# Altium schematic sheet MotherBoard.SchDoc: 3D Printer Motherboard
size Legal; DrawnBy: Sean & Zika; DocumentNumber: 1; Revision: 1.0; SheetNumber: 1; SheetTotal: 2
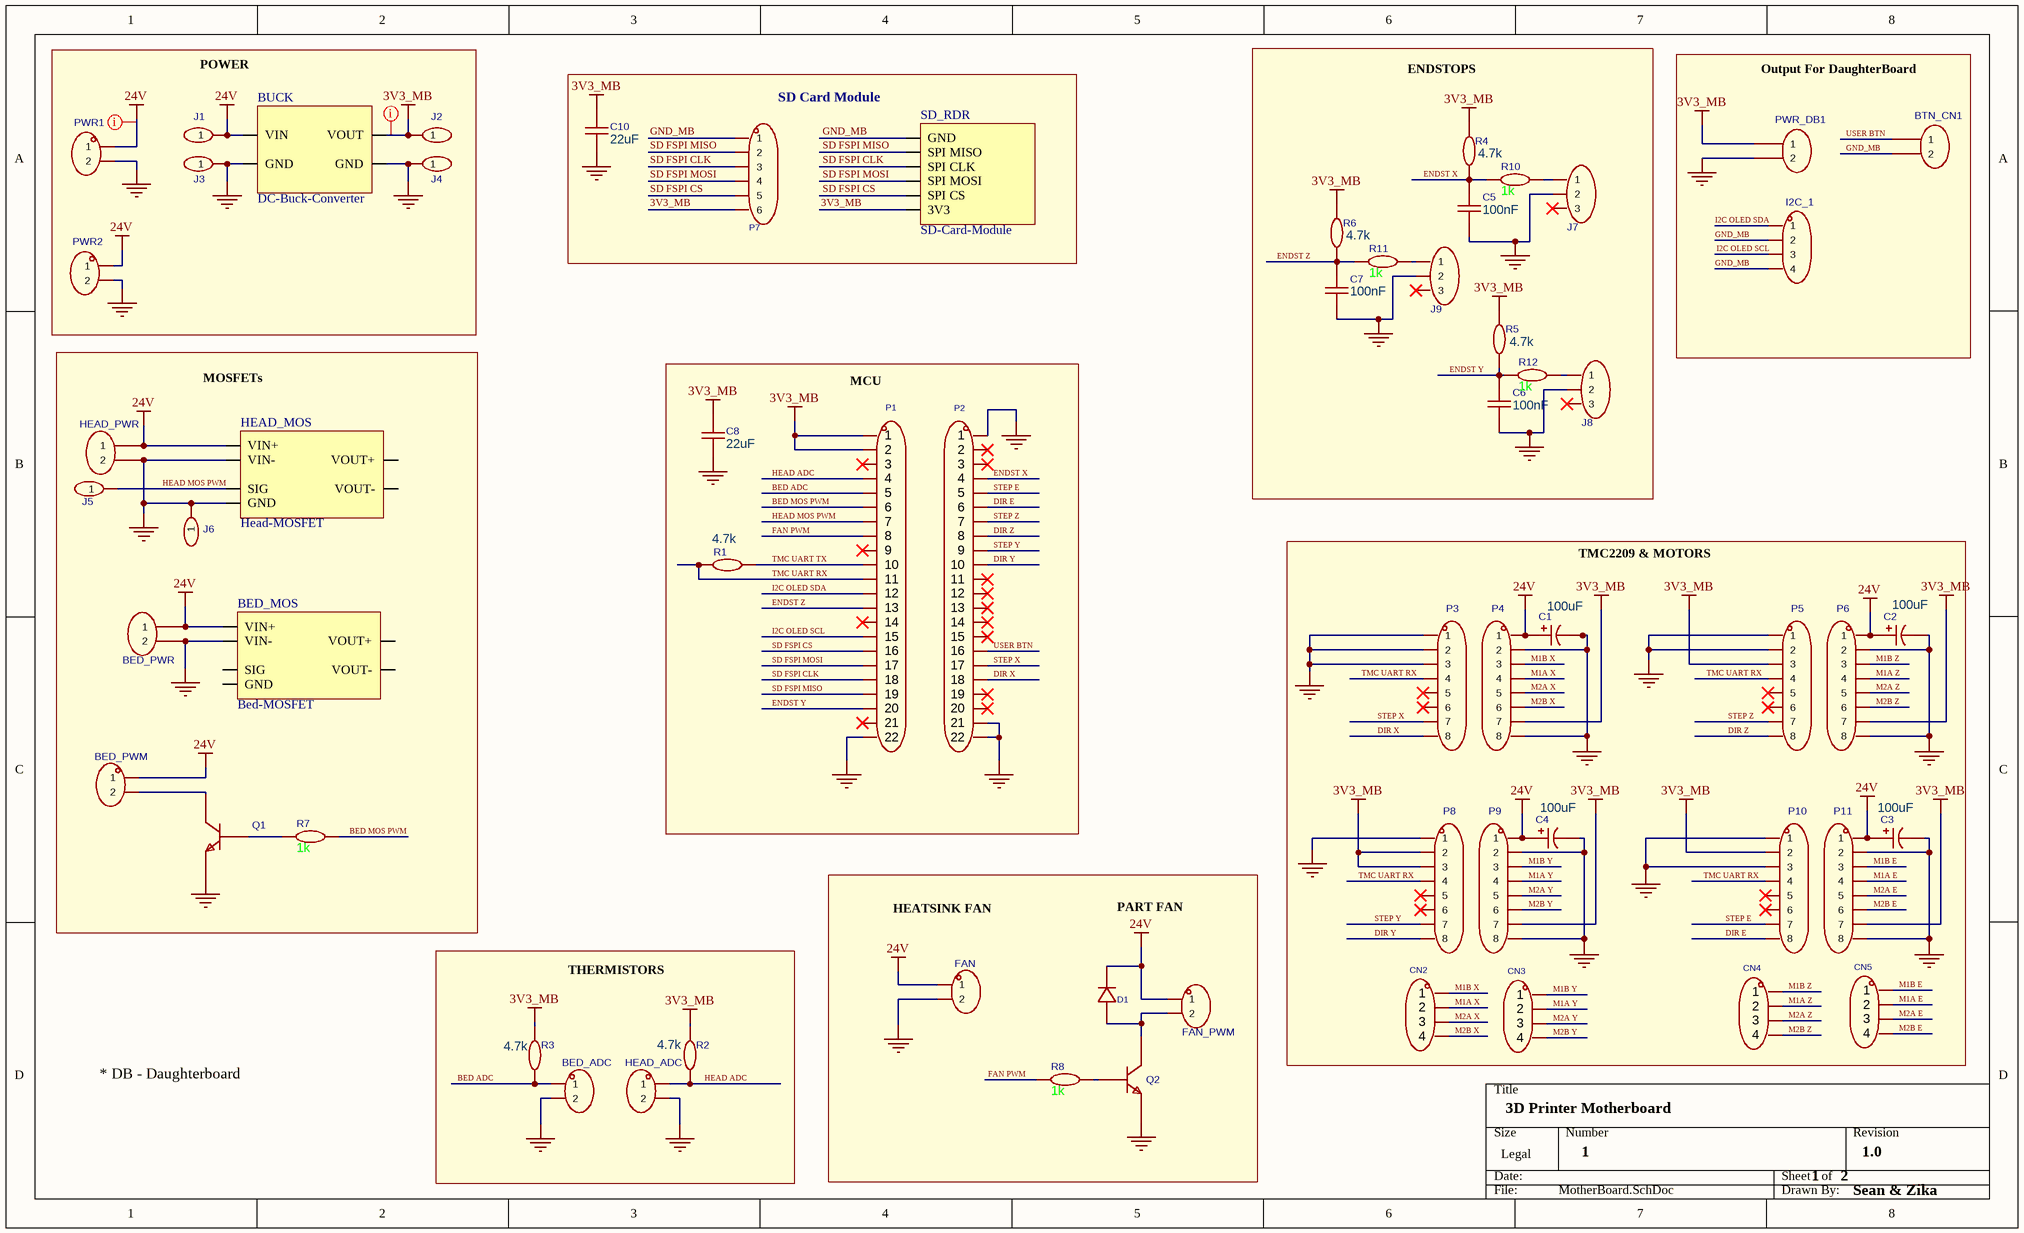
[diagram p0: MotherBoard.SchDoc]

## Parts
BED_ADC  sh-xh2.54-2p  [XH-2P]  (value not drawn)
BED_MOS  Bed-MOSFET  [Bed-MOSFET]  (graphical)
BED_PWM  sh-xh2.54-2p  [XH-2P]  (value not drawn)
BED_PWR  wj127-5.0-02p-14-00a  [Screw-Terminal-2P]  (value not drawn)
BTN_CN1  wj127-5.0-02p-14-00a  [Screw-Terminal-2P]  (value not drawn)
BUCK  DC-Buck-Converter  [DC-Buck-Converter]  (graphical)
C1  100uF  [Capacitor-100uF]
C2  100uF  [Capacitor-100uF]
C3  100uF  [Capacitor-100uF]
C4  100uF  [Capacitor-100uF]
C5  100nF  [Capacitor-100nF-0805]
C6  100nF  [Capacitor-100nF-0805]
C7  100nF  [Capacitor-100nF-0805]
C8  22uF  [Capacitor-22uF-0805]
C10  22uF  [Capacitor-22uF-0805]
CN2  sh-xh2.54-4p  [XH-4P]  (value not drawn)
CN3  sh-xh2.54-4p  [XH-4P]  (value not drawn)
CN4  sh-xh2.54-4p  [XH-4P]  (value not drawn)
CN5  sh-xh2.54-4p  [XH-4P]  (value not drawn)
D1  s3mb-13-f  [Diode-1N4007-SMA]  (value not drawn)
FAN  sh-xh2.54-2p  [XH-2P]  (value not drawn)
FAN_PWM  sh-xh2.54-2p  [XH-2P]  (value not drawn)
HEAD_ADC  sh-xh2.54-2p  [XH-2P]  (value not drawn)
HEAD_MOS  Head-MOSFET  [Head-MOSFET]  (graphical)
HEAD_PWR  wj127-5.0-02p-14-00a  [Screw-Terminal-2P]  (value not drawn)
I2C_1  wj127-5.0-04p-14-00a  [Screw-Terminal-4P]  (value not drawn)
J1  2.54-1*1p针  [Male-Header-1P]  (value not drawn)
J2  2.54-1*1p针  [Male-Header-1P]  (value not drawn)
J3  2.54-1*1p针  [Male-Header-1P]  (value not drawn)
J4  2.54-1*1p针  [Male-Header-1P]  (value not drawn)
J5  2.54-1*1p针  [Male-Header-1P]  (value not drawn)
J6  2.54-1*1p针  [Male-Header-1P]  (value not drawn)
J7  2.54-1*3p针  [Male-Header-3P]  (value not drawn)
J8  2.54-1*3p针  [Male-Header-3P]  (value not drawn)
J9  2.54-1*3p针  [Male-Header-3P]  (value not drawn)
P1  fh2.54-09-22pzd  [Female-Header-22P]  (value not drawn)
P2  fh2.54-09-22pzd  [Female-Header-22P]  (value not drawn)
P3  2.54-1*8p母环保  [Female-Header-8P]  (value not drawn)
P4  2.54-1*8p母环保  [Female-Header-8P]  (value not drawn)
P5  2.54-1*8p母环保  [Female-Header-8P]  (value not drawn)
P6  2.54-1*8p母环保  [Female-Header-8P]  (value not drawn)
P7  2.54-1*6p  [Female-Header-6P]  (value not drawn)
P8  2.54-1*8p母环保  [Female-Header-8P]  (value not drawn)
P9  2.54-1*8p母环保  [Female-Header-8P]  (value not drawn)
P10  2.54-1*8p母环保  [Female-Header-8P]  (value not drawn)
P11  2.54-1*8p母环保  [Female-Header-8P]  (value not drawn)
PWR1  dbt30s-7.62-2p-bk-p  [Barrier-Terminal-2P]  (value not drawn)
PWR2  dbt30s-7.62-2p-bk-p  [Barrier-Terminal-2P]  (value not drawn)
PWR_DB1  wj127-5.0-02p-14-00a  [Screw-Terminal-2P]  (value not drawn)
Q1  ktc3265(range:160-320)  [NPN-SOT23-30V]  (value not drawn)
Q2  ktc3265(range:160-320)  [NPN-SOT23-30V]  (value not drawn)
R1  4.7k  [Resistor-4.7k-0805]
R2  4.7k  [Resistor-4.7k-0805]
R3  4.7k  [Resistor-4.7k-0805]
R4  4.7k  [Resistor-4.7k-0805]
R5  4.7k  [Resistor-4.7k-0805]
R6  4.7k  [Resistor-4.7k-0805]
R7  1k  [Resistor-1k-0805]
R8  1k  [Resistor-1k-0805]
R10  1k  [Resistor-1k-0805]
R11  1k  [Resistor-1k-0805]
R12  1k  [Resistor-1k-0805]
SD_RDR  SD-Card-Module  [SD-Card-Module]  (graphical)

## Blocks framed on the sheet
POWER: BUCK J1-J4 PWR1 PWR2
SD Card Module: C10 P7 SD_RDR
ENDSTOPS: C5-C7 J7-J9 R4-R6 R10-R12
Output For DaughterBoard: BTN_CN1 I2C_1 PWR_DB1
MOSFETs: BED_MOS BED_PWM BED_PWR HEAD_MOS HEAD_PWR J5 J6 Q1 R7
MCU: C8 P1 P2 R1
TMC2209 & MOTORS: C1-C4 CN2-CN5 P3-P6 P8-P11
THERMISTORS: BED_ADC HEAD_ADC R2 R3

## Nets
3V3_MB: BUCK.3(VOUT) C8.2 C10.1 J2.1 P1.1 P1.2 P4.7 P5.3 P6.7 P7.6 P8.2 P8.3 P9.7 P10.2 P11.7 PWR_DB1.1 R2.1 R3.2 R4.2 R5.2 R6.2 SD_RDR.6(3V3)
24V: BED_MOS.1(VIN+) BED_PWM.1 BED_PWR.1 BUCK.1(VIN) C1.1 C2.1 C3.1 C4.1 D1.1 FAN.1 FAN_PWM.1 HEAD_MOS.1(VIN+) HEAD_PWR.1 J1.1 P4.1 P6.1 P9.1 P11.1 PWR1.1 PWR2.1
GND_MB: BED_ADC.2 BED_MOS.2(VIN-) BED_PWR.2 BTN_CN1.2 BUCK.2(GND) BUCK.4(GND) C1.2 C2.2 C3.2 C4.2 C5.1 C6.1 C7.1 C8.1 C10.2 FAN.2 HEAD_ADC.2 HEAD_MOS.2(VIN-) HEAD_MOS.4(GND) HEAD_PWR.2 I2C_1.2 I2C_1.4 J3.1 J4.1 J6.1 J7.2 J8.2 J9.2 P1.22 P2.1 P2.21 P2.22 P3.1 P3.2 P3.3 P4.2 P4.8 P5.1 P5.2 P6.2 P6.8 P7.1 P8.1 P9.2 P9.8 P10.1 P10.3 P11.2 P11.8 PWR1.2 PWR2.2 PWR_DB1.2 Q1.2(E) Q2.2(E) SD_RDR.1(GND)
BED ADC: BED_ADC.1 P1.5 R3.1
BED MOS PWM: P1.6 R7.2
DIR E: P2.6 P10.8
DIR X: P2.18 P3.8
DIR Y: P2.10 P8.8
DIR Z: P2.8 P5.8
ENDST X: C5.2 P2.4 R4.1 R10.1
ENDST Y: C6.2 P1.20 R5.1 R12.1
ENDST Z: C7.2 P1.13 R6.1 R11.1
FAN PWM: P1.8 R8.1
HEAD ADC: HEAD_ADC.1 P1.4 R2.2
HEAD MOS PWM: HEAD_MOS.3(SIG) J5.1 P1.7
I2C OLED SCL: I2C_1.3 P1.15
I2C OLED SDA: I2C_1.1 P1.12
M1A E: CN5.2 P11.4
M1A X: CN2.2 P4.4
M1A Y: CN3.2 P9.4
M1A Z: CN4.2 P6.4
M1B E: CN5.1 P11.3
M1B X: CN2.1 P4.3
M1B Y: CN3.1 P9.3
M1B Z: CN4.1 P6.3
M2A E: CN5.3 P11.5
M2A X: CN2.3 P4.5
M2A Y: CN3.3 P9.5
M2A Z: CN4.3 P6.5
M2B E: CN5.4 P11.6
M2B X: CN2.4 P4.6
M2B Y: CN3.4 P9.6
M2B Z: CN4.4 P6.6
SD FSPI CLK: P1.18 P7.3 SD_RDR.3(SPI_CLK)
SD FSPI CS: P1.16 P7.5 SD_RDR.5(SPI_CS)
SD FSPI MISO: P1.19 P7.2 SD_RDR.2(SPI_MISO)
SD FSPI MOSI: P1.17 P7.4 SD_RDR.4(SPI_MOSI)
STEP E: P2.5 P10.7
STEP X: P2.17 P3.7
STEP Y: P2.9 P8.7
STEP Z: P2.7 P5.7
TMC UART RX: P1.11 P3.4 P5.4 P8.4 P10.4 R1.2
TMC UART TX: P1.10 R1.1
USER BTN: BTN_CN1.1 P2.16
NetBED_PWM_2: BED_PWM.2 Q1.3(C)
NetD1_2: D1.2 FAN_PWM.2 Q2.3(C)
NetJ7_1: J7.1 R10.2
NetJ8_1: J8.1 R12.2
NetJ9_1: J9.1 R11.2
NetQ1_1: Q1.1(B) R7.1
NetQ2_1: Q2.1(B) R8.2

Not connected (* = marked no-connect by the designer): BED_MOS 3(SIG) 4(GND) 5(VOUT+) 6(VOUT-); HEAD_MOS 5(VOUT+) 6(VOUT-); J7 3*; J8 3*; J9 3*; P1 3* 9* 14* 21*; P2 2* 3* 11* 12* 13* 14* 15* 19* 20*; P3 5* 6*; P5 5* 6*; P8 5* 6*; P10 5* 6*

## Layout directives
net class 3V3-PWR; rule Width Constraint [Pref Width = 20mil    Min Width = 20mil    Max Width = 20mil]: 3V3_MB
net class 24V-PWR; rule Width Constraint [Pref Width = 40mil    Min Width = 40mil    Max Width = 325mil]: 24V

## Notes on the sheet
- HEATSINK FAN
- PART FAN
- * DB - Daughterboard

## Library data of the parts
BED_ADC BED_PWM FAN FAN_PWM HEAD_ADC = XH-2P: Pins Structure:1x2P Pitch:2.5mm Mounting Type:Through Hole Number of Pins:2P Number of Rows:1 Number of PINs Per Row:2 Current Rating:3A Contact Material:Brass Contact Plating:Tin Operating Temperature:-25℃~+85℃ Operating Temperature:-25℃~+85℃ Voltage Rat; Manufacturer: 深海电子; AddInBom: yes; ModelId: 0fe0934827c24a35ba1321e64395c7dc; ModelName: CONN-TH_2P-P2.50-XH2.54-2P; ModelTransform: 295.275,228.346,0,180,0,0,-0.002,-20.079,-137.795; Pins Structure: 1x2P; Pitch: 2.5mm; Number of PINs Per Row: 2; Current Rating: 3A; Voltage Rating: 250V; Plastic Material: PA66; Flame Retardant Rating: UL94V-0; Z-Height of the Board: 7.1mm; X-Length of Bottom Edge on Board (Spacing Line): 7.5mm; Y-Width of Bottom Edge on Board: 5.8mm; Symbol: SH-XH2.54-2P; LCSC Part Name: 1x2P 间距:2.5mm 直插; SupplierPart: C53261323; ManufacturerPart: SH-XH2.54-2P; Supplier Footprint: 插件,P=2.5mm; JLCPCB Part Class: Extended Part; Datasheet: https://item.szlcsc.com/datasheet/SH-XH2.54-2P/56320007.html; Supplier: LCSC; ConvertToPcb: yes; FootprintName: CONN-TH_2P-P2.50-XH2.54-2P; Mounting Type: Through Hole; Number of Pins: 2P; Number of Rows: 1; Contact Material: Brass; Contact Plating: Tin; Operating Temperature: -25℃~+85℃; Color: White
BED_PWR BTN_CN1 HEAD_PWR PWR_DB1 = Screw-Terminal-2P: Number of Positions or Pins:1x2P Pitch:5mm Color:Green Mounting Type:Through Hole Number of Pins:2P Number of Rows:1 Number of PINs Per Row:2 Screw Specification:M2.5 Current Rating:15A Voltage Rating (Max):250V Wire Gauge - AWG:14~26 Wire Gauge - mm2:1.5; Manufacturer: KANGNEX(康奈克斯电气); Symbol: WJ127-5.0-2P; AddInBom: yes; ModelId: 0c699dafc1fb4759bdee4490ad46ecba; ModelName: CONN-TH_2P-P5.00_CPC3703CTR; ModelTransform: 416.145,318.897,0,0,0,0,-11.811,5.315,-149.606; Number of Positions or Pins: 1x2P; Pitch: 5mm; Number of PINs Per Row: 2; Screw Specification: M2.5; Current Rating: 15A; Voltage Rating (Max): 250V; Wire Gauge - AWG: 14~26; Wire Gauge - mm2: 1.5; LCSC Part Name: 1x2P 5mm 直插 排数:1 每排P数:2; SupplierPart: C3703; ManufacturerPart: WJ127-5.0-02P-14-00A; Supplier Footprint: 插件,P=5mm; JLCPCB Part Class: Extended Part; Datasheet: https://item.szlcsc.com/datasheet/WJ127-5.0-02P-14-00A/4105.html; Supplier: LCSC; ConvertToPcb: yes; FootprintName: CONN-TH_2P-P5.00_CPC3703CTR; Color: Green; Mounting Type: Through Hole; Number of Pins: 2P; Number of Rows: 1; Operating Temperature: -40℃~+105℃; Height Above Board: 10.14mm
C1-C4 = Capacitor-100uF: Capacitance:100uF Tolerance:±20% Tolerance:±20% Voltage Rating:50V Ripple Current:146mA@120Hz Equivalent Series Resistance(ESR):- Diameter:8mm Height - Seated (Max):10.2mm Lifetime:2800hrs@105℃ Operating Temperature:-55℃~+105℃ Operating Temperature:-55℃~+; Manufacturer: DMBJ(振宝佳); Symbol: RVT1H101M0810 100UF 50V; AddInBom: yes; ModelId: 9f9fc6857dc54a0ab164c419dde4584d; ModelName: CAP-SMD_BD8.0-L8.3-W8.3-LS9.1-FD; ModelTransform: 358.267,326.771,0,0,0,0,0,0,0; Tolerance: ±20%; Voltage Rating: 50V; LCSC Part Name: 100uF ±20% 50V; SupplierPart: C970687; ManufacturerPart: RVT1H101M0810 100UF 50V; Supplier Footprint: SMD,D8xL10.2mm; JLCPCB Part Class: Extended Part; Datasheet: https://item.szlcsc.com/datasheet/RVT1H101M0810%2520100UF%252050V/1060415.html; Supplier: LCSC; ConvertToPcb: yes; FootprintName: CAP-SMD_BD8.0-L8.3-W8.3-LS9.1-FD; Value: 100uF; Ripple Current: 146mA@120Hz; Equivalent Series Resistance(ESR): -; Diameter: 8mm; Height - Seated (Max): 10.2mm; Lifetime: 2800hrs@105℃; Operating Temperature: -55℃~+105℃
C5-C7 = Capacitor-100nF-0805: Capacitance:100nF Tolerance:±10% Tolerance:±10% Voltage Rating:50V Temperature Coefficient:X7R; Manufacturer: SAMSUNG(三星); Symbol: CL21B104KBCNNNC; AddInBom: yes; ModelId: 8c88e81f49c6409b980720ec8953afb6; ModelName: C0805_L2.0-W1.3-H1.3; ModelTransform: 78.74,51.181,0,0,0,0,0,0.0005,0; Tolerance: ±10%; Voltage Rating: 50V; Temperature Coefficient: X7R; LCSC Part Name: 100nF ±10% 50V; SupplierPart: C1711; ManufacturerPart: CL21B104KBCNNNC; Supplier Footprint: 0805; JLCPCB Part Class: Extended Part; Datasheet: https://item.szlcsc.com/datasheet/CL21B104KBCNNNC/2063.html; Supplier: LCSC; ConvertToPcb: yes; FootprintName: C0805; Value: 100nF
C8 C10 = Capacitor-22uF-0805: Capacitance:22uF Tolerance:±20% Tolerance:±20% Voltage Rating:10V Temperature Coefficient:X5R; Manufacturer: SAMSUNG(三星); Symbol: CL21A226MPQNNNE; AddInBom: yes; ModelId: 8c88e81f49c6409b980720ec8953afb6; ModelName: C0805_L2.0-W1.3-H1.3; ModelTransform: 78.74,51.181,0,0,0,0,0,0.0005,0; Tolerance: ±20%; Voltage Rating: 10V; Temperature Coefficient: X5R; LCSC Part Name: 22uF ±20% 10V; SupplierPart: C29277; ManufacturerPart: CL21A226MPQNNNE; Supplier Footprint: 0805; JLCPCB Part Class: Extended Part; Datasheet: https://item.szlcsc.com/datasheet/CL21A226MPQNNNE/30029.html; Supplier: LCSC; ConvertToPcb: yes; FootprintName: C0805; Value: 22uF
CN2-CN5 = XH-4P: Pins Structure:1x4P Pitch:2.5mm Mounting Type:Through Hole Number of Pins:4P Number of Rows:1 Number of PINs Per Row:4 Current Rating:3A Contact Material:Brass Contact Plating:Tin Operating Temperature:-25℃~+85℃ Operating Temperature:-25℃~+85℃ Voltage Rat; Manufacturer: 深海电子; AddInBom: yes; ModelId: d6f2687bc06b47fb8e014feb06c7c5ec; ModelName: CONN-TH_4P-P2.50_4PIN; ModelTransform: 492.125,224.409,0,180,0,0,0,17.717,-118.11; Pins Structure: 1x4P; Pitch: 2.5mm; Number of PINs Per Row: 4; Current Rating: 3A; Voltage Rating: 250V; Plastic Material: PA66; Flame Retardant Rating: UL94V-0; Z-Height of the Board: 7.1mm; X-Length of Bottom Edge on Board (Spacing Line): 12.5mm; Y-Width of Bottom Edge on Board: 5.8mm; LCSC Part Name: 1x4P 间距:2.5mm 直插; SupplierPart: C53261325; ManufacturerPart: SH-XH2.54-4P; Supplier Footprint: 插件,P=2.5mm; JLCPCB Part Class: Extended Part; Datasheet: https://item.szlcsc.com/datasheet/SH-XH2.54-4P/56320009.html; Supplier: LCSC; ConvertToPcb: yes; SymbolName: SH-XH2.54-4P; FootprintName: CONN-TH_4P-P2.50_4PIN; Mounting Type: Through Hole; Number of Pins: 4P; Number of Rows: 1; Contact Material: Brass; Contact Plating: Tin; Operating Temperature: -25℃~+85℃; Color: White
D1 = Diode-1N4007-SMA: Diode Configuration:1 Independent Voltage - Forward(Vf@If):1.15V@3A Voltage - DC Reverse(Vr):1kV Current - Rectified:3A Reverse Leakage Current (Ir):10uA@1kV Non-Repetitive Peak Forward Surge Current:- Operating Junction Temperature Range:-65℃~+150℃ Opera; Manufacturer: DIODES(美台); AddInBom: yes; ModelId: 6383b9be09eb4825906cf4ce91b85cee; ModelName: SMB_L4.6-W3.6-LS5.3-RD; ModelTransform: 212.598,141.732,0,0,0,0,0,0,0; Voltage - DC Reverse(Vr): 1kV; Current - Rectified: 3A; Symbol: S3MB-13-F; SupplierPart: C70426; Supplier: LCSC; Manufacturer Part: S3MB-13-F; JLCPCB Part Class: Extended Part; LCSC Part Name: 1kV 3A; Supplier Footprint: SMB(DO-214AA); Datasheet: https://item.szlcsc.com/datasheet/S3MB-13-F/71522.html; ConvertToPcb: yes; FootprintName: SMB_L4.6-W3.6-LS5.3-RD; Diode Configuration: 1 Independent; Voltage - Forward(Vf@If): 1.15V@3A; Reverse Leakage Current (Ir): 10uA@1kV; Non-Repetitive Peak Forward Surge Current: -; Operating Junction Temperature Range: -65℃~+150℃
I2C_1 = Screw-Terminal-4P: Number of Positions or Pins:1x4P Pitch:5mm Color:Green Mounting Type:Through Hole Number of Pins:4P Number of Rows:1 Number of PINs Per Row:4 Screw Specification:M2.5 Current Rating:15A Voltage Rating (Max):250V Wire Gauge - AWG:14~26 Wire Gauge - mm2:1.5; Manufacturer: KANGNEX(康奈克斯电气); Symbol: WJ127-5.0-4P; AddInBom: yes; ModelId: 30be887f740a4f6bacb9c64f3bb40a03; ModelName: CONN-TH_WJ5.00-LI-4P-127; ModelTransform: 807.0748,318.897,0,0,0,0,-9.843,7.874,-157.48; Number of Positions or Pins: 1x4P; Pitch: 5mm; Number of PINs Per Row: 4; Screw Specification: M2.5; Current Rating: 15A; Voltage Rating (Max): 250V; Wire Gauge - AWG: 14~26; Wire Gauge - mm2: 1.5; LCSC Part Name: 1x4P 5mm 直插 排数:1 每排P数:4; SupplierPart: C192779; ManufacturerPart: WJ127-5.0-04P-14-00A; Supplier Footprint: 插件,P=5mm; JLCPCB Part Class: Extended Part; Datasheet: https://item.szlcsc.com/datasheet/WJ127-5.0-04P-14-00A/225182.html; Supplier: LCSC; ConvertToPcb: yes; FootprintName: CONN-TH_4P-P5.00_WJ127-5.0-4P; Color: Green; Mounting Type: Through Hole; Number of Pins: 4P; Number of Rows: 1; Operating Temperature: -40℃~+105℃; Height Above Board: 10.14mm
J1-J6 = Male-Header-1P: Pin Structure:1x1P Pitch:- Row Spacing:- Circluar Pins/Square Pins:Pin Header Mounting Type:Through Hole Number of Rows:1 Number of Pins:1P Current Rating:3A Voltage Rating (Max):- Length of Mating Pin:6mm Insulation Height:2.5mm Length of End Connection; Manufacturer: BOOMELE(博穆精密); Symbol: Header-Male-2.54_1x1; AddInBom: yes; ModelId: 78ee2cec6acf483d85077eb0624e0da7; ModelName: HDR2.54-M-LI-1X1P; ModelTransform: 100,100,0,0,0,0,0,0,-118.11; Pin Structure: 1x1P; Current Rating: 3A; LCSC Part Name: 1x1P 方针 直插; SupplierPart: C81276; ManufacturerPart: 2.54-1*1P针; Supplier Footprint: 插件,P=2.54mm; JLCPCB Part Class: Extended Part; Datasheet: https://item.szlcsc.com/datasheet/2.54-1*1P%25E9%2592%2588/82426.html; Supplier: LCSC; ConvertToPcb: yes; FootprintName: HDR-TH_1P-P2.54-V-M; Pitch: -; Row Spacing: -; Circluar Pins/Square Pins: Pin Header; Mounting Type: Through Hole; Number of Rows: 1; Number of Pins: 1P; Voltage Rating (Max): -; Length of Mating Pin: 6mm; Insulation Height: 2.5mm; Length of End Connection Pin: 3mm; Contact Material: Brass; Contact Plating: Gold; Operating Temperature: -55℃~+105℃; Color: Black
J7-J9 = Male-Header-3P: Pin Structure:1x3P Pitch:2.54mm Row Spacing:- Circluar Pins/Square Pins:Pin Header Mounting Type:Through Hole Number of Rows:1 Number of Pins:3P Current Rating:3A Voltage Rating (Max):- Length of Mating Pin:6mm Insulation Height:2.5mm Length of End Connec; Manufacturer: BOOMELE(博穆精密); Symbol: Header-Male-2.54_1x3; AddInBom: yes; ModelId: 3b8cf4ff435f4f2b912293f2932d0598; ModelName: HDR-M-2.54_1x3; ModelTransform: 299.9994,100,0,0,0,0,0,0,-118.11; Pin Structure: 1x3P; Pitch: 2.54mm; Current Rating: 3A; LCSC Part Name: 1x3P 间距:2.54mm 方针 直插; SupplierPart: C49257; ManufacturerPart: 2.54-1*3P针; Supplier Footprint: 插件,P=2.54mm; JLCPCB Part Class: Extended Part; Datasheet: https://item.szlcsc.com/datasheet/2.54-1*3P%25E9%2592%2588/50265.html; Supplier: LCSC; ConvertToPcb: yes; FootprintName: HDR-TH_3P-P2.54-V-M-1; Row Spacing: -; Circluar Pins/Square Pins: Pin Header; Mounting Type: Through Hole; Number of Rows: 1; Number of Pins: 3P; Voltage Rating (Max): -; Length of Mating Pin: 6mm; Insulation Height: 2.5mm; Length of End Connection Pin: 3mm; Contact Material: Brass; Contact Plating: Gold; Operating Temperature: -40℃~+105℃; Color: Black
P1 P2 = Female-Header-22P: Holes Structure:1x22P Pitch:2.54mm Circular Hole / Square Hole:Square Hole Mounting Type:Through Hole Number of Rows:1 Number of Positions:22P Current Rating:3A Holes Direction:Top Insulation Height:8.5mm Contact Material:Brass Contact Plating:Gold Operat; Manufacturer: XUNPU(讯普); AddInBom: yes; ModelId: 676cdefe1703484f8a37377e34cf1f64; ModelName: HDR-TH_22P-P2.54-V-F; ModelTransform: 2199.99552,98.425,0,0,0,0,0,0,-125.984; Holes Structure: 1x22P; Pitch: 2.54mm; Number of Positions: 22P; Current Rating: 3A; Holes Direction: Top; PIN Length: 3.2mm; LCSC Part Name: 1x22P 间距:2.54mm 直插; SupplierPart: C7500786; ManufacturerPart: FH2.54-09-22PZD; Supplier Footprint: 插件,P=2.54mm; JLCPCB Part Class: Extended Part; Datasheet: https://item.szlcsc.com/datasheet/FH2.54-09-22PZD/8579590.html; Supplier: LCSC; ConvertToPcb: yes; SymbolName: FH2.54-09-22PZD; FootprintName: HDR-TH_22P-P2.54-V-F; Circular Hole / Square Hole: Square Hole; Mounting Type: Through Hole; Number of Rows: 1; Insulation Height: 8.5mm; Contact Material: Brass; Contact Plating: Gold; Operating Temperature: -40℃~+105℃
P3-P6 P8-P11 = Female-Header-8P: Holes Structure:1x8P Pitch:2.54mm Row Spacing:- Circular Hole / Square Hole:Square Hole Mounting Type:Through Hole Number of Rows:1 Number of Positions:8P Current Rating:3A Holes Direction:Top Insulation Height:8.5mm Contact Material:Brass Contact Plating; Manufacturer: BOOMELE(博穆精密); Symbol: Header-Female-2.54_1x8; AddInBom: yes; ModelId: 6ab1dac21d924c3d8eea0dfa46d42ff5; ModelName: HDR-TH_8P-P2.54-V-F; ModelTransform: 819.723,98.425,0,0,0,0,0,0,-118.11; Holes Structure: 1x8P; Pitch: 2.54mm; Number of Positions: 8P; Current Rating: 3A; Holes Direction: Top; PIN Length: 3.2mm; LCSC Part Name: 1x8P 间距:2.54mm 直插; SupplierPart: C27438; ManufacturerPart: 2.54-1*8P母环保; Supplier Footprint: 插件,P=2.54mm; JLCPCB Part Class: Extended Part; Datasheet: https://item.szlcsc.com/datasheet/2.54-1*8P%25E6%25AF%258D%25E7%258E%25AF%25E4%25BF%259D/28187.html; Supplier: LCSC; ConvertToPcb: yes; FootprintName: HDR-TH_8P-P2.54-V-F; Row Spacing: -; Circular Hole / Square Hole: Square Hole; Mounting Type: Through Hole; Number of Rows: 1; Insulation Height: 8.5mm; Contact Material: Brass; Contact Plating: Gold; Operating Temperature: -55℃~+105℃
P7 = Female-Header-6P: Holes Structure:1x6P Pitch:2.54mm Row Spacing:- Circular Hole / Square Hole:Square Hole Mounting Type:Through Hole Number of Rows:1 Number of Positions:6P Current Rating:3A Voltage Rating (Max):- Holes Direction:Top Insulation Height:8.5mm Contact Materia; Manufacturer: BOOMELE(博穆精密); Manufacturer Part: 2.54-1*6P母; Symbol: Header-Female-2.54_1x6; AddInBom: yes; ModelId: 72da3eac8a074bb0a56a474e38d1760c; ModelName: HDR-TH_6P-P2.54-V-F; ModelTransform: 619.684,94.488,0,0,0,0,0,0,-125.984; Holes Structure: 1x6P; Pitch: 2.54mm; Number of Positions: 6P; Current Rating: 3A; Holes Direction: Top; PIN Length: 3.2mm; Supplier: LCSC; SupplierPart: C40877; JLCPCB Part Class: Extended Part; LCSC Part Name: 1x6P 间距:2.54mm 直插; Supplier Footprint: 插件,P=2.54mm; Datasheet: https://item.szlcsc.com/datasheet/2.54-1*6P%25E6%25AF%258D/41861.html; ConvertToPcb: yes; FootprintName: HDR-TH_6P-P2.54-V-F; Row Spacing: -; Circular Hole / Square Hole: Square Hole; Mounting Type: Through Hole; Number of Rows: 1; Voltage Rating (Max): -; Insulation Height: 8.5mm; Contact Material: Brass; Contact Plating: Gold; Operating Temperature: -40℃~+105℃; Supplementary Features: -
PWR1 PWR2 = Barrier-Terminal-2P: Barrier Type:2-Side Pitch:7.62mm Number of Positions or Pins:1x2P Mounting Type:Straight Pin Location:Side Mount Number of Pins:2P Number of Rows:1 Number of PINs Per Row:2 Current Rating:15A Voltage Rating (Max):300V Wire Gauge - AWG:14~22 Wire Gauge - m; Manufacturer: DORABO(地博电气); AddInBom: yes; ModelId: 25793e1725c44f5c9873d21a6b0bc5c1; ModelName: CONN-TH_DBT30S-7.62-2P; ModelTransform: 659.0538,531.495,0,0,0,0,0,-150.276,-169.291; Barrier Type: 2-Side; Pitch: 7.62mm; Number of Positions or Pins: 1x2P; Number of PINs Per Row: 2; Current Rating: 15A; Voltage Rating (Max): 300V; Wire Gauge - AWG: 14~22; Symbol: DBT30S-7.62-2P; LCSC Part Name: 7.62mm 1x2P 直插 边脚 排数:1 每排P数:2; SupplierPart: C918082; ManufacturerPart: DBT30S-7.62-2P-BK-P; Supplier Footprint: 插件,P=7.62mm; JLCPCB Part Class: Extended Part; Datasheet: https://item.szlcsc.com/datasheet/DBT30S-7.62-2P-BK-P/993661.html; Supplier: LCSC; ConvertToPcb: yes; FootprintName: CONN-TH_DBT30S-7.62-2P; Mounting Type: Straight; Pin Location: Side Mount; Number of Pins: 2P; Number of Rows: 1; Wire Gauge - mm2: -; Operating Temperature: -40℃~+105℃; Color: Black
Q1 Q2 = NPN-SOT23-30V: type:NPN Current - Collector(Ic):800mA Collector - Emitter Voltage VCEO:30V Pd - Power Dissipation:200mW DC Current Gain:160 DC Current Gain:160 Transition frequency(fT):120MHz Current - Collector Cutoff:100nA Vce Saturation(VCE(sat)):500mV Operating Temp; Manufacturer: CJ(江苏长电/长晶); Symbol: KTC3265 EY; AddInBom: yes; ModelId: 62a57c6760504a01965db6419a6d07df; ModelName: SOT-23-3P_L2.9-W1.3-H1.0-LS2.4-P0.95; ModelTransform: 98.425,114.173,0,180,0,0,0.0005,-0.0005,0; type: NPN; Current - Collector(Ic): 800mA; Collector - Emitter Voltage VCEO: 30V; Pd - Power Dissipation: 200mW; DC Current Gain: 160; Transition frequency(fT): 120MHz; Current - Collector Cutoff: 100nA; Vce Saturation(VCE(sat)): 500mV; Emitter-Base Voltage(Vebo): 5V; Number: 1 NPN; LCSC Part Name: hfe=160~320 NPN 电流:800mA 电压:30V; SupplierPart: C8531; ManufacturerPart: KTC3265(RANGE:160-320); Supplier Footprint: SOT-23; JLCPCB Part Class: Extended Part; Datasheet: https://item.szlcsc.com/datasheet/KTC3265(RANGE%253A160-320)/9026.html; Supplier: LCSC; ConvertToPcb: yes; FootprintName: SOT-23-3_L2.9-W1.3-P1.90-LS2.4-BR; Operating Temperature: -55℃~+150℃
R1-R6 = Resistor-4.7k-0805: Type:Thick Film Resistors Resistance:4.7kΩ Tolerance:±1% Tolerance:±1% Power(Watts): Overload Voltage (Max): Temperature Coefficient:±100ppm/℃ Temperature Coefficient:±100ppm/℃ Operating Temperature Range:-55℃~+155℃ Operating Temperature Range:-55℃~+155℃; Manufacturer: UNI-ROYAL(厚声); Symbol: 0805W8F4701T5E; AddInBom: yes; ModelId: b83c7c5430874b8eb2319a65d9433429; ModelName: R0805_L2.0-W1.3-H0.6; ModelTransform: 78.74,51.181,0,0,0,0,0,-0.0005,0; Value: 4.7kΩ; Tolerance: ±1%; LCSC Part Name: 4.7kΩ ±1% 125mW 厚膜电阻; SupplierPart: C17673; ManufacturerPart: 0805W8F4701T5E; Supplier Footprint: 0805; JLCPCB Part Class: Basic Part; Datasheet: https://atta.szlcsc.com/upload/public/pdf/source/20200306/C422600_1E6D84923E4A46A82E41ADD87F860B5C.pdf; Supplier: LCSC; ConvertToPcb: yes; FootprintName: R0805; Type: Thick Film Resistors; Temperature Coefficient: ±100ppm/℃; Operating Temperature Range: -55℃~+155℃
R7 R8 R10-R12 = Resistor-1k-0805: Type:Thick Film Resistors Resistance:1kΩ Tolerance:±1% Tolerance:±1% Power(Watts): Overload Voltage (Max): Temperature Coefficient:±100ppm/℃ Temperature Coefficient:±100ppm/℃ Operating Temperature Range:-55℃~+155℃ Operating Temperature Range:-55℃~+155℃; Manufacturer: UNI-ROYAL(厚声); Symbol: 0805W8F1001T5E; AddInBom: yes; ModelId: b83c7c5430874b8eb2319a65d9433429; ModelName: R0805_L2.0-W1.3-H0.6; ModelTransform: 78.74,51.181,0,0,0,0,0,-0.0005,0; Value: 1kΩ; Tolerance: ±1%; LCSC Part Name: 1kΩ ±1% 125mW 厚膜电阻; SupplierPart: C17513; ManufacturerPart: 0805W8F1001T5E; Supplier Footprint: 0805; JLCPCB Part Class: Basic Part; Datasheet: https://atta.szlcsc.com/upload/public/pdf/source/20200306/C422600_1E6D84923E4A46A82E41ADD87F860B5C.pdf; Supplier: LCSC; ConvertToPcb: yes; FootprintName: R0805; Type: Thick Film Resistors; Temperature Coefficient: ±100ppm/℃; Operating Temperature Range: -55℃~+155℃